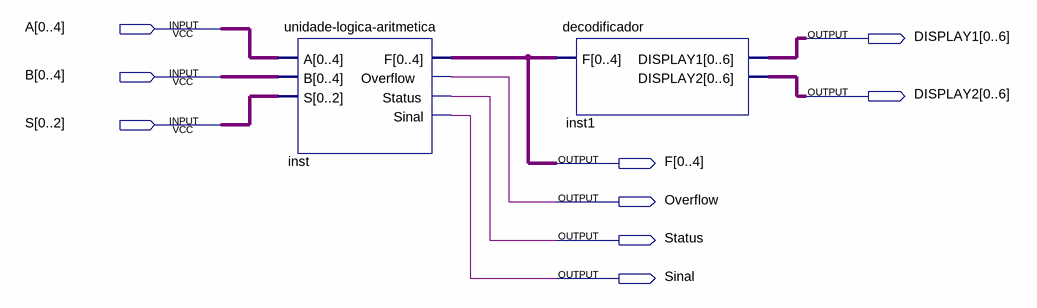
[diagram p0: schematic sheet]
// Quartus schematic ULA.bdf as structural Verilog: 2 symbols, 9 pins
module ULA (
  input  [0:4] A,
  input  [0:4] B,
  input  [0:2] S,
  output [0:6] DISPLAY1,
  output [0:6] DISPLAY2,
  output [0:4] F,
  output Overflow,
  output Status,
  output Sinal
);

  \unidade-logica-aritmetica  inst (.A(A), .B(B), .S(S), .F(F), .Overflow(Overflow), .Status(Status), .Sinal(Sinal));
  decodificador inst1 (.F(F), .DISPLAY1(DISPLAY1), .DISPLAY2(DISPLAY2));
endmodule
